# Altium project V9_BMU_REV44.PrjPcb (part 1 of 3)
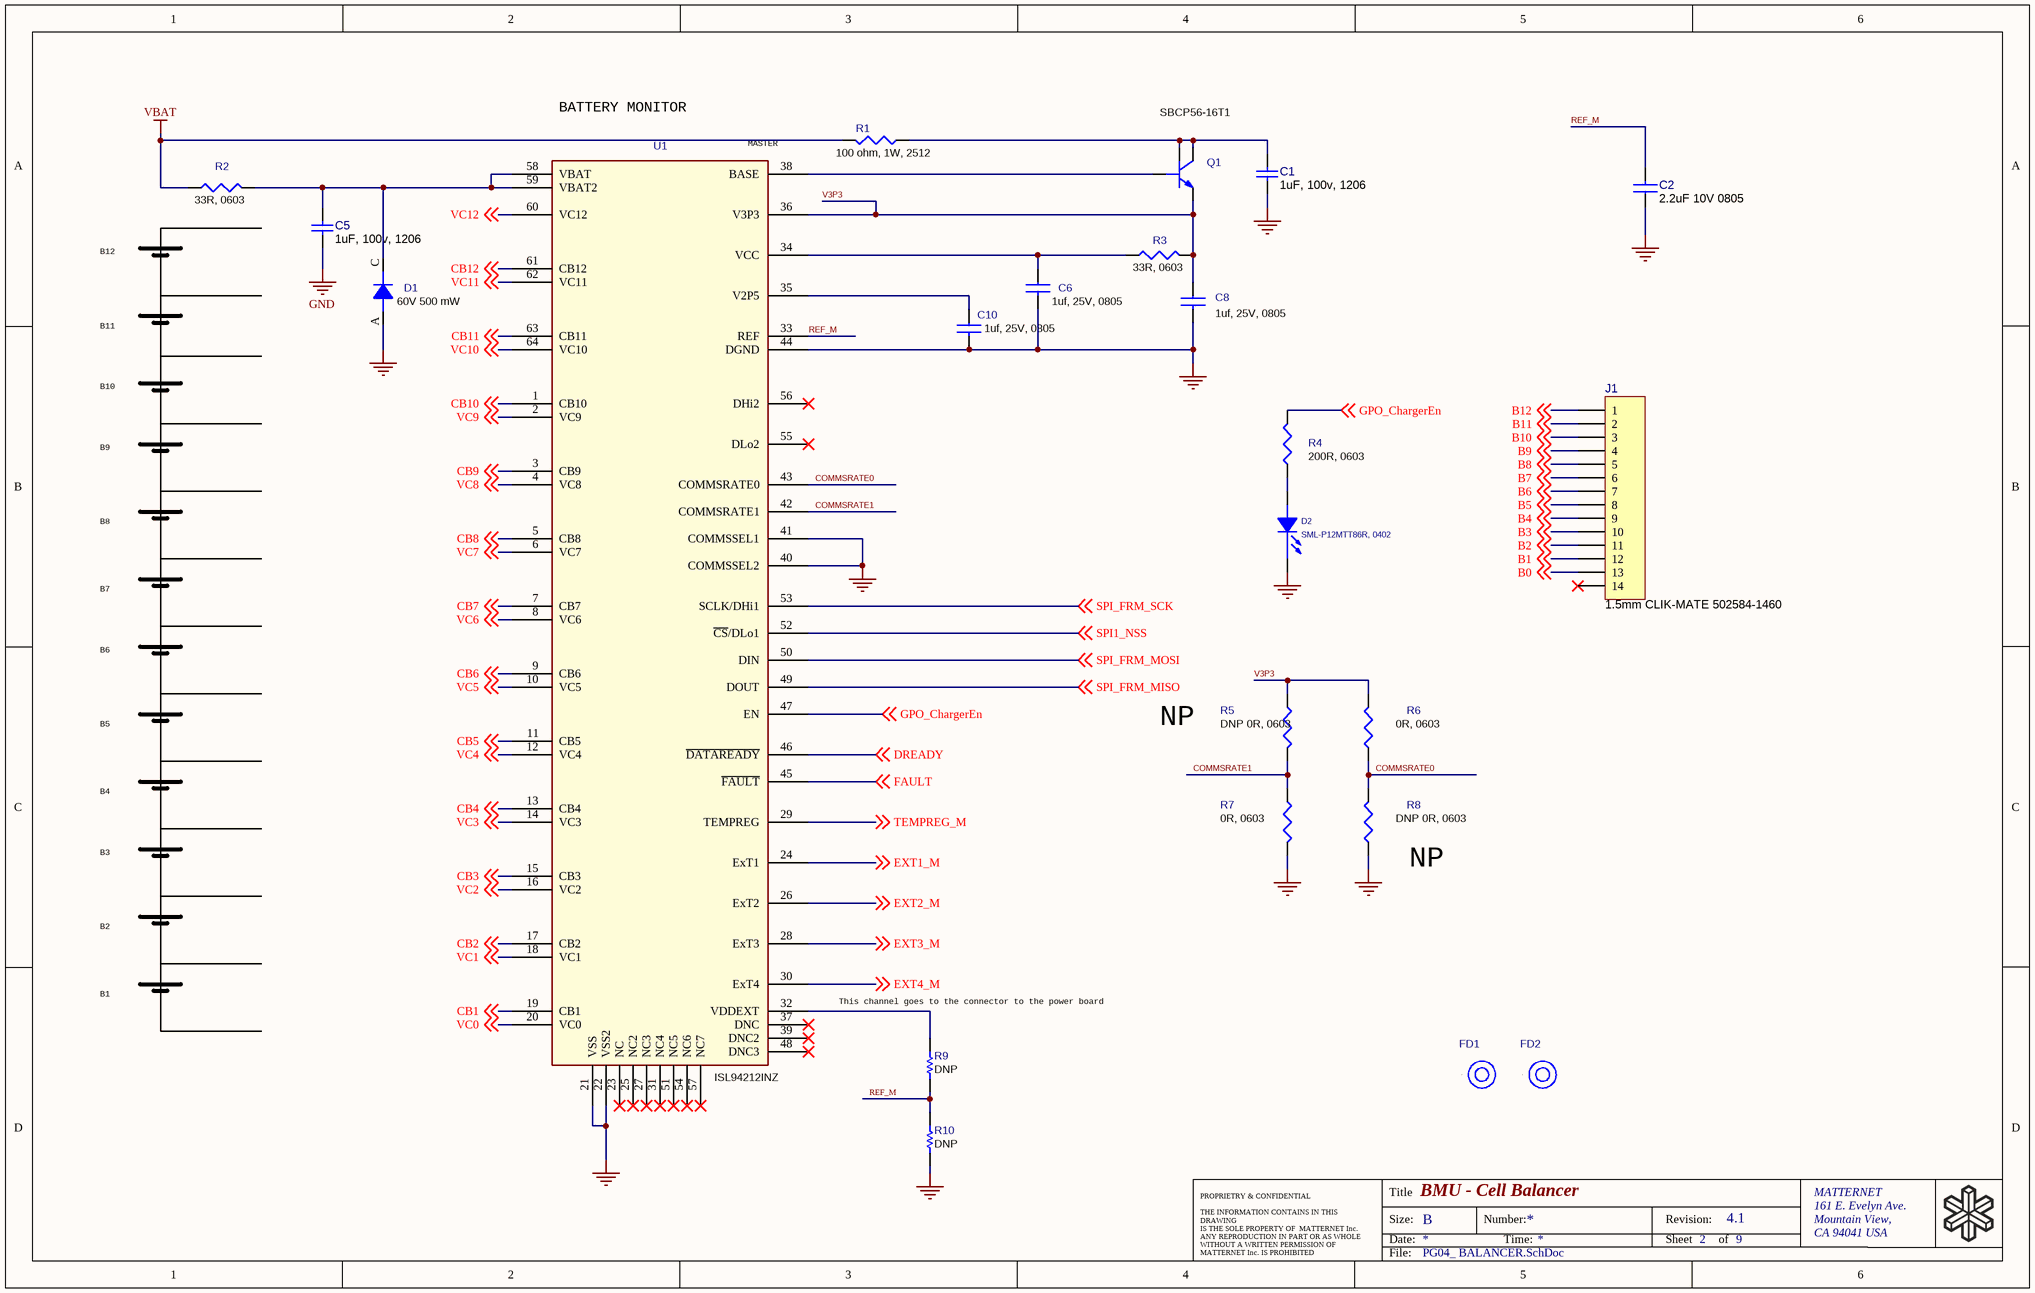
[diagram p0: PG04_ BALANCER.SchDoc]
8 sheets, 263 parts. Net scope: global (net labels, ports and power ports of the same name join across sheets).
Board file: PCB.PcbDoc
Sheets:
  PG04_ BALANCER.SchDoc
  PG05_ CELLS.SchDoc
  PG09_ TEMP_BALANCER.SchDoc
  PG10_ MCU.SchDoc
  PG11_ CAN_CONN.SchDoc
  PG12_CURRENT_INTEGRATION.SchDoc
  PG14_ POWER CONTROL.SchDoc
  PG15_ Fuel Gauge.SchDoc

## Sheet PG04_ BALANCER.SchDoc: BMU - Cell Balancer
size B; Address1: 3511 EDISON WAY; Address2: MENLO PARK, CA, 94025; Revision: 4.1; SheetNumber: 2; SheetTotal: 9

### Parts
C1  1uF, 100v, 1206  [C1206]
C2  2.2uF 10V 0805  [C0805]
C5  1uF, 100v, 1206  [C1206]
C6  1uf, 25V, 0805  [C0805]
C8  1uf, 25V, 0805  [C0805]
C10  1uf, 25V, 0805  [C0805]
D1  60V 500 mW  [SOD-123]
D2  SML-P12MTT86R, 0402  [D0402]
FD1  FIDUCIAL_REF  [FIDUCIAL_REFDES]  (value not drawn)  (no BOM)
FD2  FIDUCIAL_REF  [FIDUCIAL_REFDES]  (value not drawn)  (no BOM)
J1  1.5mm CLIK-MATE 502584-1460  [CONN14_1p5mm_SM]
Q1  SBCP56-16T1  [SOT-223]
R1  100 ohm, 1W, 2512  [2512]
R2  33R, 0603  [R0603]
R3  33R, 0603  [R0603]
R4  200R, 0603  [R0603]
R5  DNP 0R, 0603  [R0603]  (no BOM)
R6  0R, 0603  [R0603]
R7  0R, 0603  [R0603]
R8  DNP 0R, 0603  [R0603]  (no BOM)
R9  DNP  [R0402]  (no BOM)
R10  DNP  [R0402]  (no BOM)
U1  ISL94212INZ  [TQFP-64]

### Nets
GND: C1.2 C2.1 C5.1 C6.2 C8.2 C10.2 D1.A(ANODE) D2.C(CATHODE) R7.2 R8.2 R10.1 U1.21(VSS) U1.22(VSS2) U1.40(COMMSSEL2) U1.41(COMMSSEL1) U1.44(DGND)
VBAT: R1.2 R2.1
B0: J1.13 ; off-sheet B0
B1: J1.12 ; off-sheet B1
B2: J1.11 ; off-sheet B2
B3: J1.10 ; off-sheet B3
B4: J1.9 ; off-sheet B4
B5: J1.8 ; off-sheet B5
B6: J1.7 ; off-sheet B6
B7: J1.6 ; off-sheet B7
B8: J1.5 ; off-sheet B8
B9: J1.4 ; off-sheet B9
B10: J1.3 ; off-sheet B10
B11: J1.2 ; off-sheet B11
B12: J1.1 ; off-sheet B12
CB1: U1.19(CB1) ; off-sheet CB1
CB2: U1.17(CB2) ; off-sheet CB2
CB3: U1.15(CB3) ; off-sheet CB3
CB4: U1.13(CB4) ; off-sheet CB4
CB5: U1.11(CB5) ; off-sheet CB5
CB6: U1.9(CB6) ; off-sheet CB6
CB7: U1.7(CB7) ; off-sheet CB7
CB8: U1.5(CB8) ; off-sheet CB8
CB9: U1.3(CB9) ; off-sheet CB9
CB10: U1.1(CB10) ; off-sheet CB10
CB11: U1.63(CB11) ; off-sheet CB11
CB12: U1.61(CB12) ; off-sheet CB12
COMMSRATE0: R6.2 R8.1 U1.43(COMMSRATE0)
COMMSRATE1: R5.2 R7.1 U1.42(COMMSRATE1)
DREADY: U1.46(~{DATAREADY}) ; off-sheet DREADY
EXT1_M: U1.24(ExT1) ; off-sheet EXT1_M
EXT2_M: U1.26(ExT2) ; off-sheet EXT2_M
EXT3_M: U1.28(ExT3) ; off-sheet EXT3_M
EXT4_M: U1.30(ExT4) ; off-sheet EXT4_M
FAULT: U1.45(~{FAULT}) ; off-sheet FAULT
GPO_ChargerEn: R4.2 U1.47(EN) ; off-sheet GPO_ChargerEn
REF_M: C2.2 R9.1 R10.2 U1.33(REF)
SPI1_NSS: U1.52(~{CS}/DLo1) ; off-sheet SPI1_NSS
SPI_FRM_MISO: U1.49(DOUT) ; off-sheet SPI_FRM_MISO
SPI_FRM_MOSI: U1.50(DIN) ; off-sheet SPI_FRM_MOSI
SPI_FRM_SCK: U1.53(SCLK/DHi1) ; off-sheet SPI_FRM_SCK
TEMPREG_M: U1.29(TEMPREG) ; off-sheet TEMPREG_M
V3P3: C8.1 Q1.3(E) R3.2 R5.1 R6.1 U1.36(V3P3)
VC0: U1.20(VC0) ; off-sheet VC0
VC1: U1.18(VC1) ; off-sheet VC1
VC2: U1.16(VC2) ; off-sheet VC2
VC3: U1.14(VC3) ; off-sheet VC3
VC4: U1.12(VC4) ; off-sheet VC4
VC5: U1.10(VC5) ; off-sheet VC5
VC6: U1.8(VC6) ; off-sheet VC6
VC7: U1.6(VC7) ; off-sheet VC7
VC8: U1.4(VC8) ; off-sheet VC8
VC9: U1.2(VC9) ; off-sheet VC9
VC10: U1.64(VC10) ; off-sheet VC10
VC11: U1.62(VC11) ; off-sheet VC11
VC12: U1.60(VC12) ; off-sheet VC12
NetC1_1: C1.1 Q1.2(C) Q1.4(C) R1.1
NetC5_2: C5.2 D1.C(CATHODE) R2.2 U1.58(VBAT) U1.59(VBAT2)
NetC6_1: C6.1 R3.1 U1.34(VCC)
NetC10_1: C10.1 U1.35(V2P5)
NetD2_A: D2.A(ANODE) R4.1
NetQ1_1: Q1.1(B) U1.38(BASE)
NetR9_2: R9.2 U1.32(VDDEXT)

Not connected (* = marked no-connect by the designer): FD1 1; FD2 1; J1 14*; U1 23(NC)* 25(NC2)* 27(NC3)* 31(NC4)* 37(DNC)* 39(DNC2)* 48(DNC3)* 51(NC5)* 54(NC6)* 55(DLo2)* 56(DHi2)* 57(NC7)*

### Notes on the sheet
- BATTERY MONITOR
- (near U1) MASTER
- B12
- B11
- B10
- B9
- B8
- B7
- B6
- B5
- NP
- B4
- B3
- (near R8) NP
- B2
- B1
- (near R9) This channel goes to the connector to the power board
- Title
- Size:
- Date:
- B
- Number:
- Time:
- Revision:
- Sheet
- of
- MATTERNET
- 161 E. Evelyn Ave.
- Mountain View,
- CA 94041 USA
- PROPRIETRY & CONFIDENTIAL
  THE INFORMATION CONTAINS IN THIS DRAWING
  IS THE SOLE PROPERTY OF  MATTERNET Inc.
  ANY REPRODUCTION IN PART OR AS WHOLE
  WITHOUT A WRITTEN PERMISSION OF
  MATTERNET Inc. IS PROHIBITED
- File:

### Library data of the parts
C1 C5 = Cap: CAP CER 1UF 100V X7R 1210 AUTO F; Manufacturer: KEMET; Manufacturer Part Number: C1210X105K1RACAUTO; Dielectric Material: Ceramic; Tolerance: 10%; Supplier 1: Digi-Key; Supplier Part Number 1: 399-16434-1-ND; Stock 1: 335; Pricing 1: 1=2.07, 10=1.677, 100=1.2803, 500=0.9755, 1000=0.85356 (USD); Case/Package: 1210; Voltage Rating (DC): 100V; Dielectric: X7R; Capacitance: 1uF
C2 = CAP-Generic-0805: CAP CER 2.2UF 10V 10% X7R 0805; Manufacturer: KEMET; Manufacturer Part Number: C0805X225K8RACAUTO; Dielectric Material: Ceramic; Supplier 1: Digi-Key; Supplier Part Number 1: 399-11602-1-ND; Stock 1: 2328; Pricing 1: 1=0.9, 10=0.667, 100=0.4571, 500=0.36184, 1000=0.3047 (USD); Mount: Surface Mount; Case/Package: 0805; Case Code (Metric): 2012; Case Code (Imperial): 0805; Min Operating Temperature: -55°C; Max Operating Temperature: 125°C; Packaging: Tape and Reel; Capacitance: 2.2uF; Voltage Rating: 10V; Tolerance: 10%; Voltage Rating (DC): 10V; Dielectric: X7R; Features: Soft Termination; Length: 0.079inch; Width: 0.049inch; Thickness: 0.055inch; Ratings: AEC-Q200; Supplier 2: Mouser; Supplier Part Number 2: 80-C0805X225K8RAUTO; Stock 2: 4965; Pricing 2: 1=1.06, 10=0.715, 50=0.715, 100=0.446, 1000=0.369, 10000=0.228 (USD)
C6 C8 C10 = CAP-Generic-0402: CAP CER 1UF 25V X7R 0805; Manufacturer: Murata; Manufacturer Part Number: GCJ21BR71E105KA12L; Tolerance: 10%; Supplier 1: Digi-Key; Supplier Part Number 1: 490-5802-1-ND; Stock 1: 116649; Pricing 1: 1=0.48, 10=0.333, 100=0.1997, 500=0.14974, 1000=0.12645 (USD); Mount: Surface Mount; Case/Package: 0805; Case Code (Imperial): 0805; Case Code (Metric): 2012; Min Operating Temperature: -55°C; Max Operating Temperature: 125°C; Capacitance: 1uF; Voltage Rating: 25V; Voltage Rating (DC): 25V; Packaging: Tape and Reel; Package Quantity: 3000; Dielectric: X7R; Termination: SMD/SMT; Features: Soft Termination; Length: 2mm; Width: 1.25mm; Thickness: 0.057inch; Depth: 1.25mm; Ratings: AEC-Q200; Lead Free: Lead Free
D1 = DIO-GENERIC: DIODE ZENER 60V 500MW SOD123; Manufacturer: ON Semiconductor; Manufacturer Part Number: MMSZ5264BT1G; custprt: 100-0500-000184; custinv: Ansync; Option: AB; Material: Plastic; Tolerance: 5%; Impedance: 170R; Forward Voltage: 900mV; Max Reverse Leakage Current: 100nA; Zener Current: 10mA; Test Current: 2.1mA; Element Configuration: Single; ESD Protection: Yes; Supplier 1: Digi-Key; Supplier Part Number 1: MMSZ5264BT1GOSCT-ND; Stock 1: 0; Pricing 1: 1=0.25, 10=0.201, 100=0.1067, 500=0.07016, 1000=0.04771 (USD); Case/Package: SOD-123-2; Number of Pins: 2; Contact Plating: Matte,Tin; Min Operating Temperature: -55°C; Max Operating Temperature: 150°C; Packaging: Tape and Reel; Max Power Dissipation: 500mW; Zener Voltage: 60V; Voltage Rating (DC): 60V; Power Rating: 500mW; Package Quantity: 1; Voltage Tolerance: 5%; Power Dissipation: 500mW; Working Voltage: 60V; Peak Reverse Current: 100nA; Length: 2.84mm; Height: 1.25mm; Width: 1.8mm; Radiation Hardening: No; Lead Free: Lead Free; ComponentLink1URL: http://www.onsemi.com/pub/Collateral/MMSZ5221BT1-D.PDF; ComponentLink1Description: http://www.onsemi.com/pub/Collateral/MMSZ5221BT1-D.PDF; ComponentLink2URL: https://www.verical.com/server-webapp/html/getDatasheet?partID=107391; ComponentLink2Description: https://www.verical.com/server-webapp/html/getDatasheet?partID=107391; ComponentLink3URL: http://www.mouser.com/ds/2/308/MMSZ5221BT1-D-85810.pdf; ComponentLink3Description: http://www.mouser.com/ds/2/308/MMSZ5221BT1-D-85810.pdf; ComponentLink4URL: http://www.onsemi.com/pub_link/Collateral/MMSZ5221BT1-D.PDF; ComponentLink4Description: http://www.onsemi.com/pub_link/Collateral/MMSZ5221BT1-D.PDF; ComponentLink5URL: http://uk.rs-online.com/webdocs/1276/0900766b81276af2.pdf; ComponentLink5Description: http://uk.rs-online.com/webdocs/1276/0900766b81276af2.pdf; Supplier 2: Mouser; Supplier Part Number 2: 863-MMSZ5264BT1G; Stock 2: 694; Pricing 2: 1=0.23, 10=0.156, 50=0.156, 100=0.065, 1000=0.045, 10000=0.03 (USD)
D2 = LED-GENERIC: custinv: Ansync; custprt: 100-0500-000159; Option: AB
FD1 FD2 = FIDUCIAL_REF: Option: AB
J1 = Header 14: CONN RCPT 14POS 0.059 TIN SMD; Manufacturer: Molex; Current Rating: 2A; Voltage Rating: 100V; Number of Positions: 14; Connector Type: Forked,Receptacle; Gender: Female; Glow Wire Compliant: Non-compliant; ComponentLink1URL: http://www.mouser.com/ds/2/276/5025841460_PCB_RECEPTACLES-179505.pdf; ComponentLink1Description: http://www.mouser.com/ds/2/276/5025841460_PCB_RECEPTACLES-179505.pdf; ComponentLink2URL: http://www.molex.com/pdm_docs/sd/5025841460_sd.pdf; ComponentLink2Description: http://www.molex.com/pdm_docs/sd/5025841460_sd.pdf; ComponentLink3URL: http://www.molex.com/webdocs/datasheets/pdf/en-us/5025841460_PCB_RECEPTACLES.pdf; ComponentLink3Description: http://www.molex.com/webdocs/datasheets/pdf/en-us/5025841460_PCB_RECEPTACLES.pdf; Supplier 1: Digikey; Supplier Part Number 1: WM20814CT-ND; Manufacturer Part Number: 502584-1460; Stock 1: 900; Pricing 1: 1=2.58, 10=2.341, 100=2.0064 (USD); Mount: Surface Mount; Color: Beige; Contact Plating: Tin; Contact Gender: Female; Package Quantity: 900; Number of Rows: 1; Packaging: Tape and Reel; Fastening Type: Latch; Termination: Solder; Number of Contacts: 14; Orientation: Vertical; Number of Circuits: 14; Pitch: 1.5mm; Radiation Hardening: No; REACH SVHC: No SVHC; Supplier 2: Mouser; Supplier Part Number 2: 538-502584-1460; Stock 2: 5330; Pricing 2: 1=1.96, 10=1.75, 50=1.75, 100=1.52, 1000=1.09, 10000=0.96 (USD); ComponentLink4URL: http://www.mouser.com/ds/2/276/5025841460_PCB_RECEPTACLES-179505.pdf?src-supplier=Mouser; ComponentLink4Description: http://www.mouser.com/ds/2/276/5025841460_PCB_RECEPTACLES-179505.pdf?src-supplier=Mouser; ComponentLink5URL: http://www.molex.com/pdm_docs/sd/5025841460_sd.pdf?src-supplier=Digi-Key; ComponentLink5Description: http://www.molex.com/pdm_docs/sd/5025841460_sd.pdf?src-supplier=Digi-Key; ComponentLink6URL: http://www.molex.com/webdocs/datasheets/pdf/en-us/5025841460_PCB_RECEPTACLES.pdf?src-supplier=Avnet; ComponentLink6Description: http://www.molex.com/webdocs/datasheets/pdf/en-us/5025841460_PCB_RECEPTACLES.pdf?src-supplier=Avnet
Q1 = Trans-Generic_2: TRANS NPN 80V 1.0A SOT-223; Manufacturer: ON Semiconductor; Manufacturer Part Number: SBCP56-16T1G; Max Power Dissipation: 1.5W; Frequency: 130MHz; hFE Min: 25; Max Collector Current: 1A; Collector Emitter Saturation Voltage: 500mV; Collector Base Voltage (VCBO): 100V; Number of Elements: 1; Emitter Base Voltage (VEBO): 5V; Element Configuration: Single; Supplier 1: Digi-Key; Supplier Part Number 1: SBCP56-16T1GOSCT-ND; Stock 1: 10870; Pricing 1: 1=0.59, 10=0.505, 100=0.3767, 500=0.29598 (USD); Case/Package: SOT-223-4; Number of Pins: 4; Min Operating Temperature: -65°C; Max Operating Temperature: 150°C; Package Quantity: 1000; Packaging: Tape and Reel; Collector Emitter Voltage (VCEO): 80V; Transition Frequency: 130MHz; Collector Emitter Breakdown Voltage: 80V; Polarity: NPN; Max Breakdown Voltage: 80V; Power Dissipation: 1.5W; Gain Bandwidth Product: 130MHz; Max Frequency: 130MHz; Length: 6.7mm; Height: 1.65mm; Width: 3.7mm; Radiation Hardening: No; Lead Free: Lead Free; ComponentLink1URL: http://www.onsemi.com/pub/Collateral/BCP56T1-D.PDF?src-supplier=Digi-Key; ComponentLink1Description: http://www.onsemi.com/pub/Collateral/BCP56T1-D.PDF?src-supplier=Digi-Key; ComponentLink2URL: http://www.onsemi.com/pub_link/Collateral/BCP56T1-D.PDF?src-supplier=Future+Electronics; ComponentLink2Description: http://www.onsemi.com/pub_link/Collateral/BCP56T1-D.PDF?src-supplier=Future+Electronics; ComponentLink3URL: http://www.onsemi.com/pub/Collateral/BCP56T1-D.PDF?src-supplier=Avnet+Europe; ComponentLink3Description: http://www.onsemi.com/pub/Collateral/BCP56T1-D.PDF?src-supplier=Avnet+Europe; Supplier 2: Mouser; Supplier Part Number 2: 863-SBCP56-16T1G; Stock 2: 108192; Pricing 2: 1=0.55, 10=0.45, 50=0.45, 100=0.274, 1000=0.212, 10000=0.168 (USD)
R1 = R-Generic: RES SMD 100 OHM 5% 1W 2512; Manufacturer: Panasonic; Manufacturer Part Number: ERJ-1TYJ101U; custprt: 100-0100-000214; custinv: Ansync; Option: AB; Resistance: 100R; Temperature Coefficient: 200ppm/°C; Voltage Rating: 200V; Voltage Rating (DC): 250V; Supplier 1: Mouser; Supplier Part Number 1: 667-ERJ-1TYJ101U; Stock 1: 275; Pricing 1: 1=0.39, 10=0.28, 50=0.169, 100=0.125, 1000=0.07, 10000=0.053 (USD); Mount: Surface Mount; Case/Package: 2512; Contact Plating: Tin; Case Code (Metric): 6432; Case Code (Imperial): 2512; Min Operating Temperature: -55°C; Max Operating Temperature: 155°C; Tolerance: 5%; Power Rating: 1W; Composition: Thick Film; Packaging: Tape and Reel; Package Quantity: 4000; Number of Terminations: 2; Termination: SMD/SMT; Military Standard: Not; Max Power Dissipation: 1W; Features: Automotive AEC-Q200; Length: 6.4mm; Height: 0.6mm; Width: 0.126inch; Depth: 3.2mm; Radiation Hardening: No; REACH SVHC: No SVHC; Lead Free: Lead Free; ComponentLink1URL: http://www.farnell.com/datasheets/1678796.pdf; ComponentLink1Description: http://www.farnell.com/datasheets/1678796.pdf; ComponentLink2URL: http://industrial.panasonic.com/www-data/pdf/AOA0000/AOA0000CE1.pdf; ComponentLink2Description: http://industrial.panasonic.com/www-data/pdf/AOA0000/AOA0000CE1.pdf; ComponentLink3URL: http://www.mouser.com/ds/2/315/AOA0000C84-947596.pdf; ComponentLink3Description: http://www.mouser.com/ds/2/315/AOA0000C84-947596.pdf; ComponentLink4URL: https://www.alliedelec.com/m/d/51cd0790071e1666bdb9d00c57fcf960.pdf; ComponentLink4Description: https://www.alliedelec.com/m/d/51cd0790071e1666bdb9d00c57fcf960.pdf
R2 R3 = R-Generic-0603: RES SMD 33 OHM 1% 1/10W 0603; Manufacturer: Yageo; Manufacturer Part Number: AC0603FR-0733RL; custprt: 100-0110-000153; custinv: Ansync; Option: AB; Power Rating: 100mW; Voltage Rating: 50V; Temperature Coefficient: 100ppm/°C; Supplier 1: Digi-Key; Supplier Part Number 1: YAG3599CT-ND; Stock 1: 70551; Pricing 1: 1=0.1, 10=0.032, 100=0.0129, 1000=0.00579, 2500=0.00502 (USD); Case/Package: 0603; Case Code (Imperial): 0603; Case Code (Metric): 1608; Min Operating Temperature: -55°C; Max Operating Temperature: 155°C; Packaging: Tape and Reel; Resistance: 33R; Tolerance: 1%; Composition: Thick Film; Termination: SMD/SMT; Number of Terminations: 2; Max Power Dissipation: 100mW; Features: Automotive AEC-Q200,Moisture Resistant; Length: 0.063inch; Height: 0.022inch; Width: 0.8mm
R4 = R-Generic-0603: RES SMD 200 OHM 1% 1/10W 0603; Manufacturer: Yageo; Manufacturer Part Number: AC0603FR-07200RL; custprt: 100-0110-000074; custinv: Ansync; Option: AB; Max Power Dissipation: 100mW; Temperature Coefficient: 100ppm/°C; Supplier 1: Digi-Key; Supplier Part Number 1: YAG3576CT-ND; Stock 1: 46237; Pricing 1: 1=0.1, 10=0.032, 100=0.0129, 1000=0.00579, 2500=0.00502 (USD); Case/Package: 0603; Case Code (Metric): 1608; Case Code (Imperial): 0603; Min Operating Temperature: -55°C; Max Operating Temperature: 155°C; Packaging: Tape and Reel; Resistance: 200R; Composition: Thick Film; Number of Terminations: 2; Tolerance: 1%; Features: Automotive AEC-Q200,Moisture Resistant; Length: 0.063inch; Height: 0.022inch; Width: 0.031inch
R5 R8 = R-Generic-0402: DNP; custinv: Ansync; custprt: 100-0120-000002; Option: N
R6 R7 = R-Generic-0402: RES SMD 0 OHM JUMPER 1/10W 0603; Manufacturer: Yageo; Manufacturer Part Number: RC0603FR-070RL; custinv: Ansync; custprt: 100-0120-000002; Option: AB; Resistance: 0mR; Power Rating: 100mW; Tolerance: 1%; Voltage Rating (DC): 50V; Temperature Coefficient: 200ppm/°C; Current Rating: 1A; Working Voltage: 75V; Supplier 1: Digi-Key; Supplier Part Number 1: 311-0.0HRCT-ND; Stock 1: 3289463; Pricing 1: 1=0.1, 10=0.021, 25=0.0152, 50=0.0114, 100=0.0084, 250=0.00644, 500=0.00514, 1000=0.00379 (USD); Case/Package: 0603; Number of Pins: 2; Contact Plating: Matte,Tin; Case Code (Metric): 1608; Case Code (Imperial): 0603; Min Operating Temperature: -55°C; Max Operating Temperature: 155°C; Composition: Thick Film; Packaging: Tape and Reel; Package Quantity: 5000; Voltage Rating: 50V; Number of Terminations: 2; Termination: SMD/SMT; Military Standard: Not; Max Power Dissipation: 100mW; Features: Moisture Resistant; Length: 1.6mm; Height: 0.45mm; Width: 0.031inch; Depth: 0.8mm; Radiation Hardening: No; REACH SVHC: No SVHC; Lead Free: Lead Free; ComponentLink1URL: http://www.farnell.com/datasheets/1868787.pdf; ComponentLink1Description: http://www.farnell.com/datasheets/1868787.pdf; ComponentLink2URL: http://www.farnell.com/datasheets/443971.pdf; ComponentLink2Description: http://www.farnell.com/datasheets/443971.pdf; ComponentLink3URL: http://www.yageo.com/documents/recent/PYu-RC_Group_51_RoHS_L_9.pdf; ComponentLink3Description: http://www.yageo.com/documents/recent/PYu-RC_Group_51_RoHS_L_9.pdf; ComponentLink4URL: http://documents.rs-components.com/techlib://itc_doclist_GB.htm?stockno=5048827; ComponentLink4Description: http://documents.rs-components.com/techlib://itc_doclist_GB.htm?stockno=5048827
R9 R10 = Res1: Resistor; Published: 8-Jun-2000; LatestRevisionDate: 17-Jul-2002; LatestRevisionNote: Re-released for DXP Platform.; PackageReference: AXIAL-0.3; Publisher: Altium Limited; PackageDescription: Axial Device, Thru-Hole; 2 Leads; 0.3 in Pin Spacing
U1 = BATTMAN-ISL94212INZ-700-498: Battery Management Multi-Cell Li-Ion Battery Manager; Manufacturer: Renesas; Option: AB; Max Supply Current: 5mA; Mount: Surface Mount; Case/Package: QFP; Number of Pins: 64; Min Operating Temperature: -40°C; Max Operating Temperature: 85°C; Package Quantity: 160; Packaging: Tray; Radiation Hardening: No; ComponentLink1URL: http://www.intersil.com/products/deviceinfo.asp?pn=ISL94212; ComponentLink1Description: http://www.intersil.com/products/deviceinfo.asp?pn=ISL94212; ComponentLink2URL: http://www.intersil.com/content/dam/Intersil/documents/isl9/isl94212.pdf; ComponentLink2Description: http://www.intersil.com/content/dam/Intersil/documents/isl9/isl94212.pdf; Supplier 1: Mouser; Supplier Part Number 1: 968-ISL94212INZ; Stock 1: 447; Pricing 1: 1=11.53, 10=10.42, 50=9.94, 100=8.63, 1000=6.55, 10000=6.55 (USD); Manufacturer Part Number: ISL94212INZ

## Sheet PG05_ CELLS.SchDoc: BMU - Cell Balancer 2
size C; Address1: 3511 EDISON WAY; Address2: MENLO PARK, CA, 94025; DocumentNumber: 1; Revision: 4.1; SheetNumber: 3; SheetTotal: 9
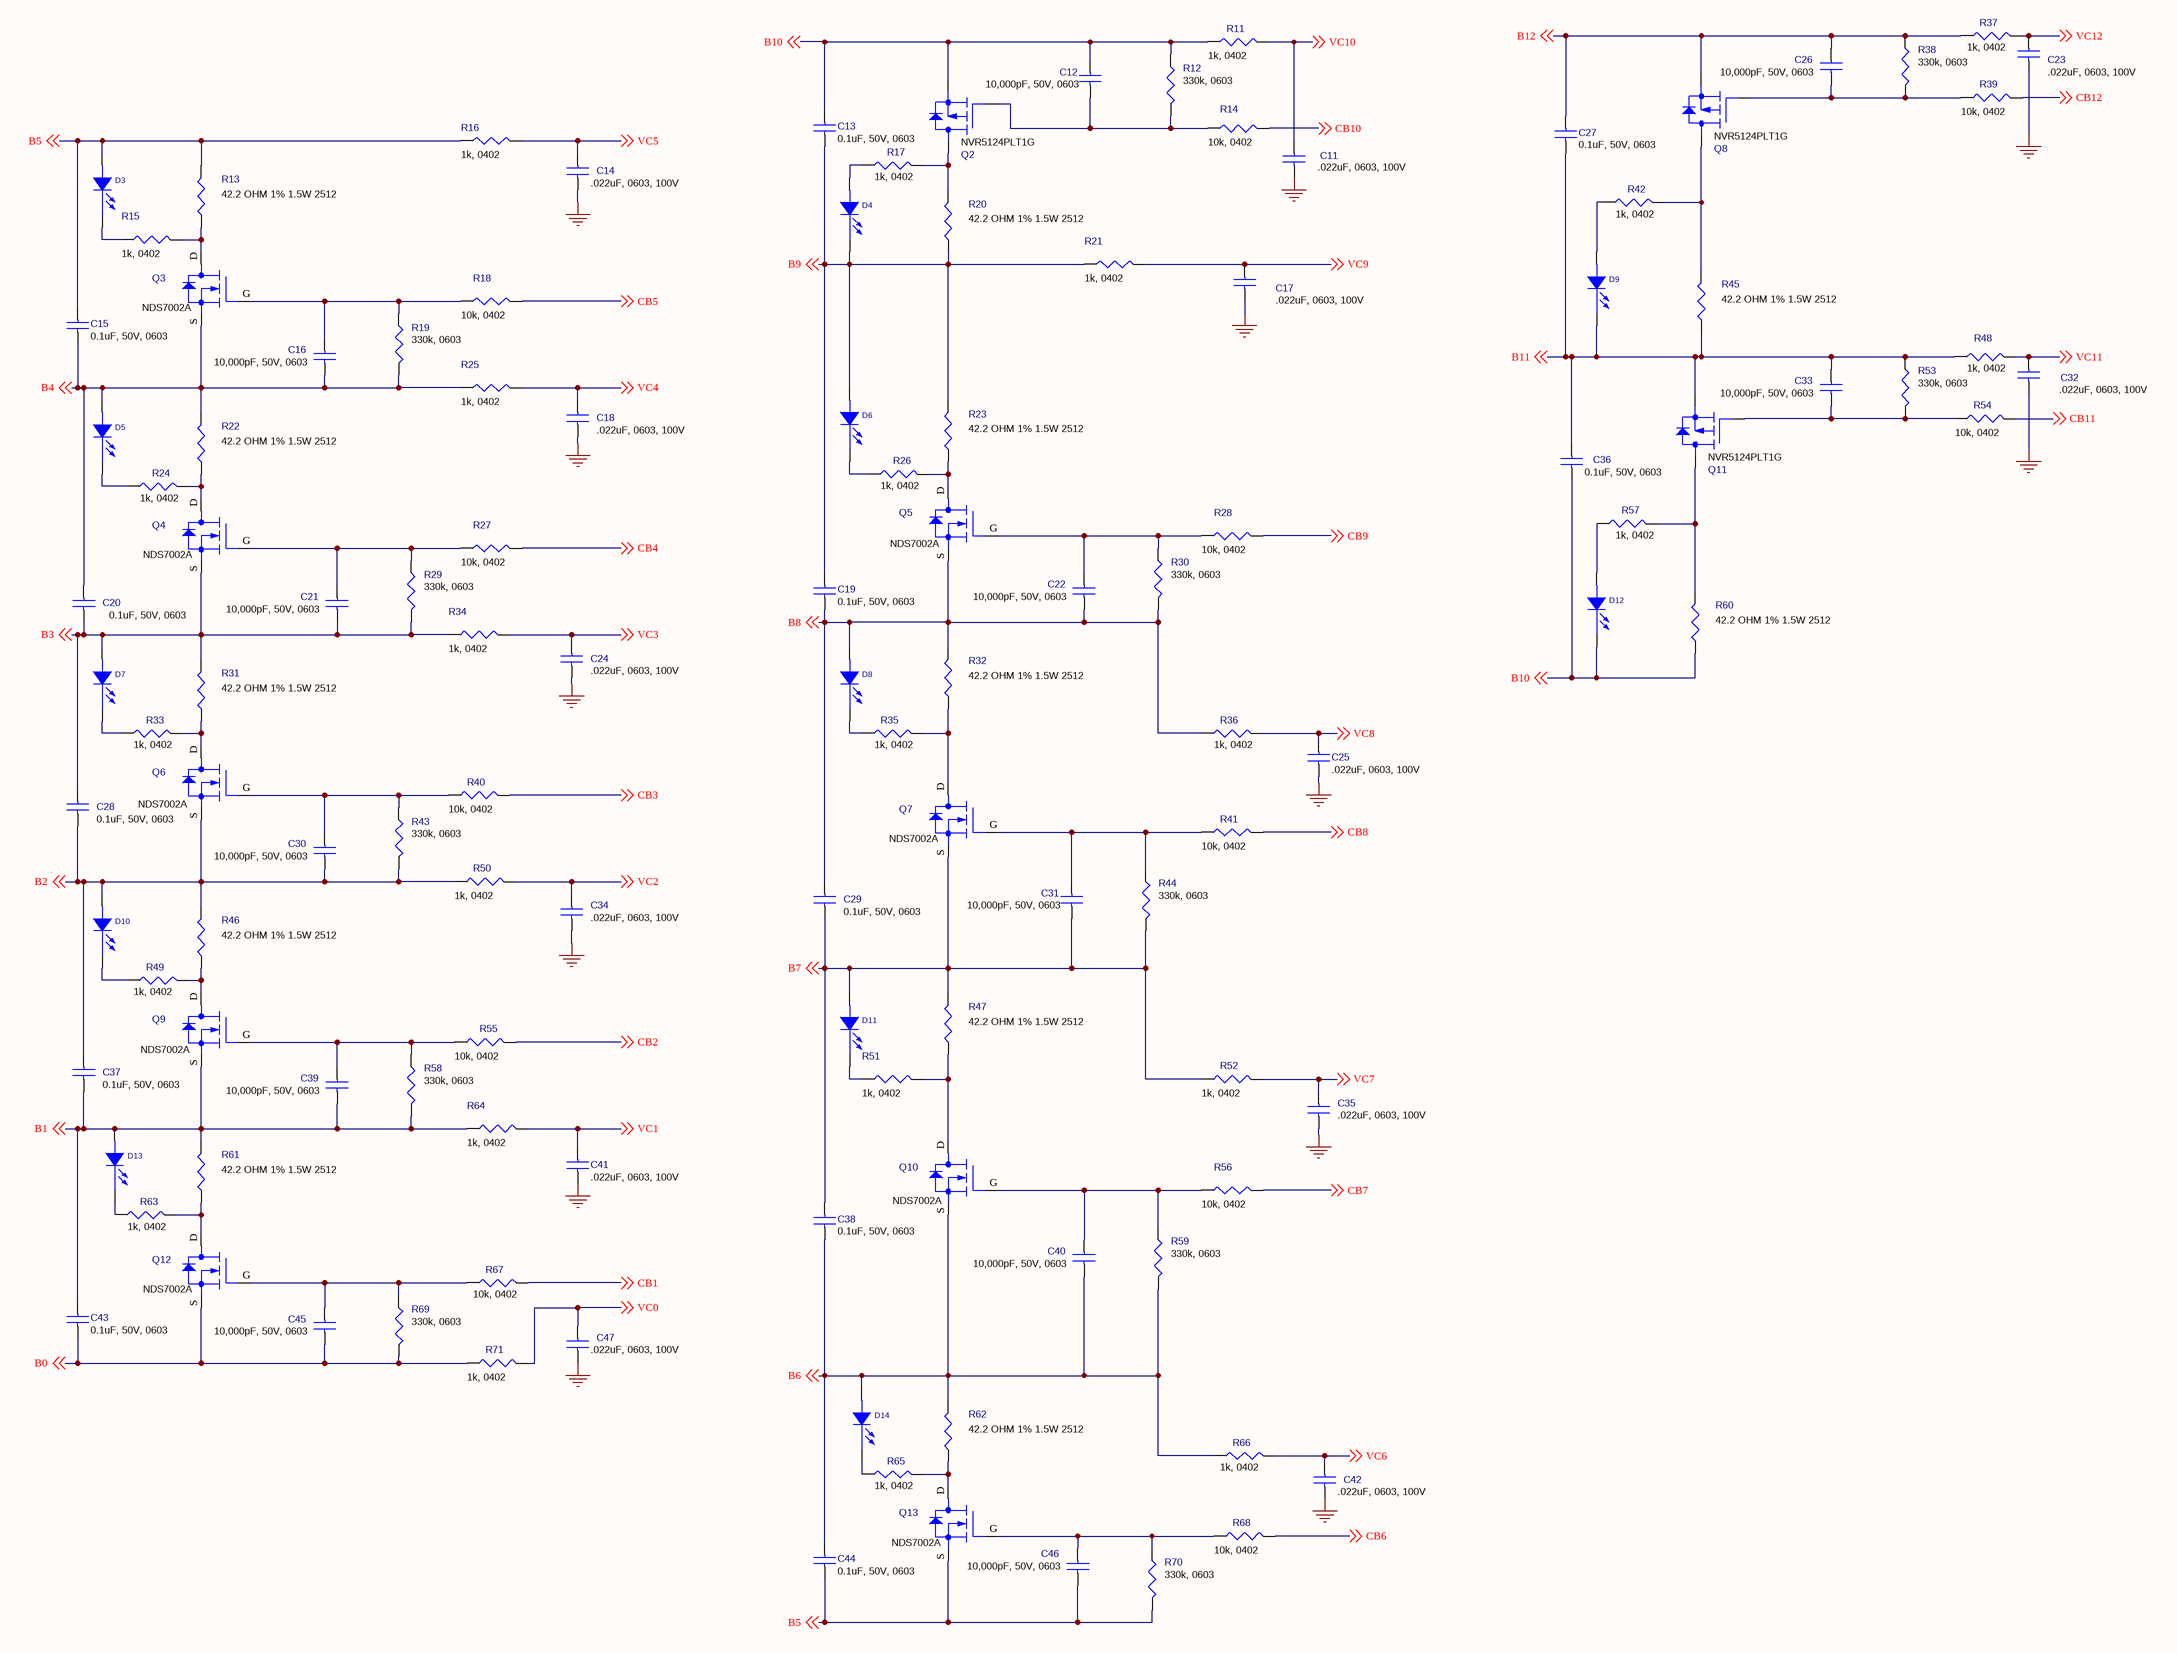
[diagram p1: PG05_ CELLS.SchDoc]

### Parts
C11  .022uF, 0603, 100V  [C0603]
C12  10,000pF, 50V, 0603  [C0603]
C13  0.1uF, 50V, 0603  [C0603]
C14  .022uF, 0603, 100V  [C0603]
C15  0.1uF, 50V, 0603  [C0603]
C16  10,000pF, 50V, 0603  [C0603]
C17  .022uF, 0603, 100V  [C0603]
C18  .022uF, 0603, 100V  [C0603]
C19  0.1uF, 50V, 0603  [C0603]
C20  0.1uF, 50V, 0603  [C0603]
C21  10,000pF, 50V, 0603  [C0603]
C22  10,000pF, 50V, 0603  [C0603]
C23  .022uF, 0603, 100V  [C0603]
C24  .022uF, 0603, 100V  [C0603]
C25  .022uF, 0603, 100V  [C0603]
C26  10,000pF, 50V, 0603  [C0603]
C27  0.1uF, 50V, 0603  [C0603]
C28  0.1uF, 50V, 0603  [C0603]
C29  0.1uF, 50V, 0603  [C0603]
C30  10,000pF, 50V, 0603  [C0603]
C31  10,000pF, 50V, 0603  [C0603]
C32  .022uF, 0603, 100V  [C0603]
C33  10,000pF, 50V, 0603  [C0603]
C34  .022uF, 0603, 100V  [C0603]
C35  .022uF, 0603, 100V  [C0603]
C36  0.1uF, 50V, 0603  [C0603]
C37  0.1uF, 50V, 0603  [C0603]
C38  0.1uF, 50V, 0603  [C0603]
C39  10,000pF, 50V, 0603  [C0603]
C40  10,000pF, 50V, 0603  [C0603]
C41  .022uF, 0603, 100V  [C0603]
C42  .022uF, 0603, 100V  [C0603]
C43  0.1uF, 50V, 0603  [C0603]
C44  0.1uF, 50V, 0603  [C0603]
C45  10,000pF, 50V, 0603  [C0603]
C46  10,000pF, 50V, 0603  [C0603]
C47  .022uF, 0603, 100V  [C0603]
D3  SML-P12MTT86R, 0402  [D0402]  (value not drawn)
D4  SML-P12MTT86R, 0402  [D0402]  (value not drawn)
D5  SML-P12MTT86R, 0402  [D0402]  (value not drawn)
D6  SML-P12MTT86R, 0402  [D0402]  (value not drawn)
D7  SML-P12MTT86R, 0402  [D0402]  (value not drawn)
D8  SML-P12MTT86R, 0402  [D0402]  (value not drawn)
D9  SML-P12MTT86R, 0402  [D0402]  (value not drawn)
D10  SML-P12MTT86R, 0402  [D0402]  (value not drawn)
D11  SML-P12MTT86R, 0402  [D0402]  (value not drawn)
D12  SML-P12MTT86R, 0402  [D0402]  (value not drawn)
D13  SML-P12MTT86R, 0402  [D0402]  (value not drawn)
D14  SML-P12MTT86R, 0402  [D0402]  (value not drawn)
Q2  NVR5124PLT1G  [SOT-23]
Q3  NDS7002A  [SOT-23]
Q4  NDS7002A  [SOT-23]
Q5  NDS7002A  [SOT-23]
Q6  NDS7002A  [SOT-23]
Q7  NDS7002A  [SOT-23]
Q8  NVR5124PLT1G  [SOT-23]
Q9  NDS7002A  [SOT-23]
Q10  NDS7002A  [SOT-23]
Q11  NVR5124PLT1G  [SOT-23]
Q12  NDS7002A  [SOT-23]
Q13  NDS7002A  [SOT-23]
R11  1k, 0402  [R0402]
R12  330k, 0603  [R0603]
R13  42.2 OHM 1% 1.5W 2512  [2512]
R14  10k, 0402  [R0402]
R15  1k, 0402  [R0402]
R16  1k, 0402  [R0402]
R17  1k, 0402  [R0402]
R18  10k, 0402  [R0402]
R19  330k, 0603  [R0603]
R20  42.2 OHM 1% 1.5W 2512  [2512]
R21  1k, 0402  [R0402]
R22  42.2 OHM 1% 1.5W 2512  [2512]
R23  42.2 OHM 1% 1.5W 2512  [2512]
R24  1k, 0402  [R0402]
R25  1k, 0402  [R0402]
R26  1k, 0402  [R0402]
R27  10k, 0402  [R0402]
R28  10k, 0402  [R0402]
R29  330k, 0603  [R0603]
R30  330k, 0603  [R0603]
R31  42.2 OHM 1% 1.5W 2512  [2512]
R32  42.2 OHM 1% 1.5W 2512  [2512]
R33  1k, 0402  [R0402]
R34  1k, 0402  [R0402]
R35  1k, 0402  [R0402]
R36  1k, 0402  [R0402]
R37  1k, 0402  [R0402]
R38  330k, 0603  [R0603]
R39  10k, 0402  [R0402]
R40  10k, 0402  [R0402]
R41  10k, 0402  [R0402]
R42  1k, 0402  [R0402]
R43  330k, 0603  [R0603]
R44  330k, 0603  [R0603]
R45  42.2 OHM 1% 1.5W 2512  [2512]
R46  42.2 OHM 1% 1.5W 2512  [2512]
R47  42.2 OHM 1% 1.5W 2512  [2512]
R48  1k, 0402  [R0402]
R49  1k, 0402  [R0402]
R50  1k, 0402  [R0402]
R51  1k, 0402  [R0402]
R52  1k, 0402  [R0402]
R53  330k, 0603  [R0603]
R54  10k, 0402  [R0402]
R55  10k, 0402  [R0402]
R56  10k, 0402  [R0402]
R57  1k, 0402  [R0402]
R58  330k, 0603  [R0603]
R59  330k, 0603  [R0603]
R60  42.2 OHM 1% 1.5W 2512  [2512]
R61  42.2 OHM 1% 1.5W 2512  [2512]
R62  42.2 OHM 1% 1.5W 2512  [2512]
R63  1k, 0402  [R0402]
R64  1k, 0402  [R0402]
R65  1k, 0402  [R0402]
R66  1k, 0402  [R0402]
R67  10k, 0402  [R0402]
R68  10k, 0402  [R0402]
R69  330k, 0603  [R0603]
R70  330k, 0603  [R0603]
R71  1k, 0402  [R0402]

### Nets
GND: C11.2 C14.2 C17.2 C18.2 C23.2 C24.2 C25.2 C32.2 C34.2 C35.2 C41.2 C42.2 C47.2
B0: C43.2 C45.2 Q12.S(SOURCE) R69.2 R71.1 ; off-sheet B0
B1: C37.2 C39.2 C43.1 D13.A(ANODE) Q9.S(SOURCE) R58.2 R61.2 R64.1 ; off-sheet B1
B2: C28.2 C30.2 C37.1 D10.A(ANODE) Q6.S(SOURCE) R43.2 R46.2 R50.1 ; off-sheet B2
B3: C20.2 C21.2 C28.1 D7.A(ANODE) Q4.S(SOURCE) R29.2 R31.2 R34.1 ; off-sheet B3
B4: C15.2 C16.2 C20.1 D5.A(ANODE) Q3.S(SOURCE) R19.2 R22.2 R25.1 ; off-sheet B4
B5: C15.1 C44.2 C46.2 D3.A(ANODE) Q13.S(SOURCE) R13.2 R16.1 R70.2 ; off-sheet B5
B6: C38.2 C40.2 C44.1 D14.A(ANODE) Q10.S(SOURCE) R59.2 R62.2 R66.1 ; off-sheet B6
B7: C29.2 C31.2 C38.1 D11.A(ANODE) Q7.S(SOURCE) R44.2 R47.2 R52.1 ; off-sheet B7
B8: C19.2 C22.2 C29.1 D8.A(ANODE) Q5.S(SOURCE) R30.2 R32.2 R36.1 ; off-sheet B8
B9: C13.2 C19.1 D4.C(CATHODE) D6.A(ANODE) R20.1 R21.1 R23.2 ; off-sheet B9
B10: C12.1 C13.1 C36.2 D12.C(CATHODE) Q2.S R11.1 R12.1 R60.1 ; off-sheet B10
B11: C27.2 C33.1 C36.1 D9.C(CATHODE) Q11.S R45.1 R48.1 R53.1 ; off-sheet B11
B12: C26.1 C27.1 Q8.S R37.1 R38.1 ; off-sheet B12
CB1: R67.2 ; off-sheet CB1
CB2: R55.2 ; off-sheet CB2
CB3: R40.2 ; off-sheet CB3
CB4: R27.2 ; off-sheet CB4
CB5: R18.2 ; off-sheet CB5
CB6: R68.2 ; off-sheet CB6
CB7: R56.2 ; off-sheet CB7
CB8: R41.2 ; off-sheet CB8
CB9: R28.2 ; off-sheet CB9
CB10: R14.2 ; off-sheet CB10
CB11: R54.2 ; off-sheet CB11
CB12: R39.2 ; off-sheet CB12
VC0: C47.1 R71.2 ; off-sheet VC0
VC1: C41.1 R64.2 ; off-sheet VC1
VC2: C34.1 R50.2 ; off-sheet VC2
VC3: C24.1 R34.2 ; off-sheet VC3
VC4: C18.1 R25.2 ; off-sheet VC4
VC5: C14.1 R16.2 ; off-sheet VC5
VC6: C42.1 R66.2 ; off-sheet VC6
VC7: C35.1 R52.2 ; off-sheet VC7
VC8: C25.1 R36.2 ; off-sheet VC8
VC9: C17.1 R21.2 ; off-sheet VC9
VC10: C11.1 R11.2 ; off-sheet VC10
VC11: C32.1 R48.2 ; off-sheet VC11
VC12: C23.1 R37.2 ; off-sheet VC12
NetC12_2: C12.2 Q2.G R12.2 R14.1
NetC16_1: C16.1 Q3.G(GATE) R18.1 R19.1
NetC21_1: C21.1 Q4.G(GATE) R27.1 R29.1
NetC22_1: C22.1 Q5.G(GATE) R28.1 R30.1
NetC26_2: C26.2 Q8.G R38.2 R39.1
NetC30_1: C30.1 Q6.G(GATE) R40.1 R43.1
NetC31_1: C31.1 Q7.G(GATE) R41.1 R44.1
NetC33_2: C33.2 Q11.G R53.2 R54.1
NetC39_1: C39.1 Q9.G(GATE) R55.1 R58.1
NetC40_1: C40.1 Q10.G(GATE) R56.1 R59.1
NetC45_1: C45.1 Q12.G(GATE) R67.1 R69.1
NetC46_1: C46.1 Q13.G(GATE) R68.1 R70.1
NetD3_C: D3.C(CATHODE) R15.1
NetD4_A: D4.A(ANODE) R17.1
NetD5_C: D5.C(CATHODE) R24.1
NetD6_C: D6.C(CATHODE) R26.1
NetD7_C: D7.C(CATHODE) R33.1
NetD8_C: D8.C(CATHODE) R35.1
NetD9_A: D9.A(ANODE) R42.1
NetD10_C: D10.C(CATHODE) R49.1
NetD11_C: D11.C(CATHODE) R51.1
NetD12_A: D12.A(ANODE) R57.1
NetD13_C: D13.C(CATHODE) R63.1
NetD14_C: D14.C(CATHODE) R65.1
NetQ2_D: Q2.D R17.2 R20.2
NetQ3_D: Q3.D(DRAIN) R13.1 R15.2
NetQ4_D: Q4.D(DRAIN) R22.1 R24.2
NetQ5_D: Q5.D(DRAIN) R23.1 R26.2
NetQ6_D: Q6.D(DRAIN) R31.1 R33.2
NetQ7_D: Q7.D(DRAIN) R32.1 R35.2
NetQ8_D: Q8.D R42.2 R45.2
NetQ9_D: Q9.D(DRAIN) R46.1 R49.2
NetQ10_D: Q10.D(DRAIN) R47.1 R51.2
NetQ11_D: Q11.D R57.2 R60.2
NetQ12_D: Q12.D(DRAIN) R61.1 R63.2
NetQ13_D: Q13.D(DRAIN) R62.1 R65.2

### Notes on the sheet
- Title
- MATTERNET
- PROPRIETRY & CONFIDENTIAL
  THE INFORMATION CONTAINS IN THIS DRAWING
  IS THE SOLE PROPERTY OF  MATTERNET Inc.
  ANY REPRODUCTION IN PART OR AS WHOLE
  WITHOUT A WRITTEN PERMISSION OF
  MATTERNET Inc. IS PROHIBITED
- Size:
- Date:
- File:
- C
- Number:
- Time:
- Revision:
- Sheet
- of
- 161 E. Evelyn Ave.
- Mountain View,
- CA 94041 USA

### Library data of the parts
C11 C14 C17 C18 C23-C25 C32 C34 C35 C41 C42 C47 = CAP-Generic-0402: CAP CER 0.022UF 100V X7R 0603; Manufacturer: Murata; Manufacturer Part Number: GCJ188R72A223KA01D; Capacitance: 22nF; Tolerance: 10%; ComponentLink1URL: http://www.mouser.com/ds/2/212/KEM_C1002_X7R_SMD-1102033.pdf; ComponentLink1Description: http://www.mouser.com/ds/2/212/KEM_C1002_X7R_SMD-1102033.pdf; ComponentLink2URL: https://www.verical.com/server-webapp/html/getDatasheet?partID=38414; ComponentLink2Description: https://www.verical.com/server-webapp/html/getDatasheet?partID=38414; Supplier 1: Digi-Key; Supplier Part Number 1: 490-5769-1-ND; Stock 1: 480265; Pricing 1: 1=0.4, 10=0.277, 100=0.1572, 500=0.11096, 1000=0.0971 (USD); Mount: Surface Mount; Case/Package: 0603; Case Code (Metric): 1608; Case Code (Imperial): 0603; Min Operating Temperature: -55°C; Max Operating Temperature: 125°C; Dielectric: X7R; Package Quantity: 4000; Voltage Rating: 100V; Packaging: Tape and Reel; Termination: SMD/SMT; Voltage Rating (DC): 100V; Features: Soft Termination; Length: 1.6mm; Height: 0.8mm; Width: 0.031inch; Thickness: 0.031inch; Depth: 0.8mm; Ratings: AEC-Q200; Radiation Hardening: No; Lead Free: Lead Free; ComponentLink3URL: https://www.murata.com/~/media/webrenewal/support/library/catalog/products/capacitor/mlcc/c03e.ashx?la=en-us&src-supplier=Digi-Key; ComponentLink3Description: https://www.murata.com/~/media/webrenewal/support/library/catalog/products/capacitor/mlcc/c03e.ashx?la=en-us&src-supplier=Digi-Key; ComponentLink4URL: http://search.murata.co.jp/Ceramy/image/img/A01X/partnumbering_e_02.pdf?src-supplier=Digi-Key; ComponentLink4Description: http://search.murata.co.jp/Ceramy/image/img/A01X/partnumbering_e_02.pdf?src-supplier=Digi-Key
C12 C16 C21 C22 C26 C30 C31 C33 C39 C40 C45 C46 = CAP-Generic-0603: CAP CER 10000PF 50V X7R 0603; Manufacturer: TDK; Manufacturer Part Number: CGA3E2X7R1H103K080AE; Capacitance: 10nF; Tolerance: 10%; Supplier 1: Digi-Key; Supplier Part Number 1: 445-15955-1-ND; Stock 1: 42633; Pricing 1: 1=0.27, 10=0.186, 100=0.0944, 500=0.06458, 1000=0.05713 (USD); Mount: Surface Mount; Case/Package: 0603; Weight: 7.1E-05oz; Case Code (Metric): 1608; Case Code (Imperial): 0603; Min Operating Temperature: -55°C; Max Operating Temperature: 125°C; Package Quantity: 4000; Packaging: Tape and Reel; Voltage Rating: 50V; Dielectric: X7R; Termination: SMD/SMT; Voltage Rating (DC): 50V; Features: Soft Termination; Length: 0.063inch; Height: 0.8mm; Width: 0.031inch; Thickness: 0.035inch; Ratings: AEC-Q200
C13 C15 C19 C20 C27-C29 C36-C38 C43 C44 = CAP-Generic-0603: CAP CER 0.1UF 50V 10% X7R 0603; Manufacturer: Murata; Manufacturer Part Number: GCJ188R71E104KA12D; Supplier 1: Digi-Key; Supplier Part Number 1: 490-16477-1-ND; Stock 1: 2560; Pricing 1: 1=0.22, 10=0.152, 100=0.077, 500=0.0527, 1000=0.04662 (USD); Case/Package: 0603; Supplier 2: Mouser; Supplier Part Number 2: 81-GCJ188R71E104KA2D; Stock 2: 47905; Pricing 2: 1=0.21, 10=0.139, 50=0.139, 100=0.071, 1000=0.043, 10000=0.035 (USD)
D3-D14 = LED-GENERIC: as D2 on sheet PG04_ BALANCER
Q2 Q8 Q11 = FET-P-CH-Generic_OP4_0: MOSFET P-CH 60V 1.1A SOT-23; Manufacturer: ON Semiconductor; Supplier 1: Digi-Key; Supplier Part Number 1: NVR5124PLT1GOSCT-ND; Manufacturer Part Number: NVR5124PLT1G; Stock 1: 6451; Pricing 1: 1=0.61, 10=0.477, 100=0.3272, 500=0.22434, 1000=0.16826 (USD); Lead Free: Lead Free; Supplier 2: Mouser; Supplier Part Number 2: 863-NVR5124PLT1G; Stock 2: 58977; Pricing 2: 1=0.48, 10=0.366, 50=0.366, 100=0.198, 1000=0.149, 10000=0.12 (USD)
Q3-Q7 Q9 Q10 Q12 Q13 = FET-NCH-GenericOp2: MOSFET N-CH 60V 280MA SOT-23; Manufacturer: ON Semiconductor / Fairchild; custprt: 100-0300-000088; custinv: Ansync; Option: AB; Drain to Source Resistance: 1.2R; Gate to Source Voltage (Vgs): 20V; Input Capacitance: 50pF; Max Power Dissipation: 300mW; Element Configuration: Single; Rds On Max: 2R; Number of Elements: 1; Threshold Voltage: 2.1V; Current: 28A; Supplier 1: Digi-Key; Supplier Part Number 1: NDS7002ACT-ND; Manufacturer Part Number: NDS7002A; Stock 1: 419; Pricing 1: 1=0.51, 10=0.368, 100=0.2168, 500=0.1227, 1000=0.09407 (USD); Mount: Surface Mount; Case/Package: SOT-23; Number of Pins: 3; Contact Plating: Matte,Tin; Min Operating Temperature: -65°C; Max Operating Temperature: 150°C; Continuous Drain Current (ID): 280mA; Packaging: Tape and Reel; Drain to Source Voltage (Vdss): 60V; Drain to Source Breakdown Voltage: 60V; Power Dissipation: 300mW; Package Quantity: 1; Voltage Rating (DC): 60V; Current Rating: 280mA; On-State Resistance: 2R; Nominal Vgs: 2.1V; Dual Supply Voltage: 60V; Voltage: 60V; Width: 3.05mm; Radiation Hardening: No; Lead Free: Lead Free; REACH SVHC: No SVHC; ComponentLink1URL: https://www.fairchildsemi.com/package-drawings/MA/MA03B.pdf; ComponentLink1Description: https://www.fairchildsemi.com/package-drawings/MA/MA03B.pdf; ComponentLink2URL: https://www.verical.com/server-webapp/html/getDatasheet?partID=44394; ComponentLink2Description: https://www.verical.com/server-webapp/html/getDatasheet?partID=44394; ComponentLink3URL: https://www.fairchildsemi.com/datasheets/ND/NDS7002A.pdf; ComponentLink3Description: https://www.fairchildsemi.com/datasheets/ND/NDS7002A.pdf; ComponentLink4URL: http://www.farnell.com/datasheets/660093.pdf; ComponentLink4Description: http://www.farnell.com/datasheets/660093.pdf; ComponentLink5URL: http://www.jameco.com/Jameco/Products/ProdDS/874832.pdf; ComponentLink5Description: http://www.jameco.com/Jameco/Products/ProdDS/874832.pdf; ComponentLink6URL: http://www.fairchildsemi.com/ds/ND/NDS7002A.pdf; ComponentLink6Description: http://www.fairchildsemi.com/ds/ND/NDS7002A.pdf; Supplier 2: Mouser; Supplier Part Number 2: 512-NDS7002A; Stock 2: 2771; Pricing 2: 1=0.41, 10=0.261, 50=0.261, 100=0.112, 1000=0.086, 10000=0.058 (USD)
R11 R15-R17 R21 R24-R26 R33-R37 R42 R48-R52 R57 R63-R66 R71 = R-Generic-0402: RES SMD 1K OHM 5% 1/16W 0402; Manufacturer: Yageo; Manufacturer Part Number: RC0402JR-071KL; custinv: Ansync; custprt: 100-0120-000074; Option: AB; Resistance: 1kR; Power Rating: 62.5mW; Voltage Rating: 50V; Temperature Coefficient: 100ppm/°C; Max Power Dissipation: 63mW; Supplier 1: Digi-Key; Supplier Part Number 1: 311-1.0KJRCT-ND; Stock 1: 18546768; Pricing 1: 1=0.1, 10=0.015, 100=0.006, 1000=0.00268, 2500=0.00233, 5000=0.00192 (USD); Case/Package: 0402; Case Code (Imperial): 0402; Case Code (Metric): 1005; Min Operating Temperature: -55°C; Max Operating Temperature: 155°C; Tolerance: 5%; Packaging: Tape and Reel; Package Quantity: 1; Termination: SMD/SMT; Composition: Thick Film; Number of Terminations: 2; Military Standard: Not; Features: Moisture Resistant; Length: 0.039inch; Height: 0.016inch; Width: 0.02inch; Depth: 0.5mm; REACH SVHC: No SVHC; Lead Free: Lead Free; ComponentLink1URL: http://www.yageo.com/documents/recent/PYu-RC_Group_51_RoHS_L_9.pdf; ComponentLink1Description: http://www.yageo.com/documents/recent/PYu-RC_Group_51_RoHS_L_9.pdf; ComponentLink2URL: http://www.farnell.com/datasheets/1018594.pdf; ComponentLink2Description: http://www.farnell.com/datasheets/1018594.pdf; ComponentLink3URL: http://www.yageo.com/documents/recent/PYu-RC0402_51_RoHS_L_6_r.pdf; ComponentLink3Description: http://www.yageo.com/documents/recent/PYu-RC0402_51_RoHS_L_6_r.pdf
R12 R19 R29 R30 R38 R43 R44 R53 R58 R59 R69 R70 = R-Generic-0603: RES SMD 330K OHM 5% 1/10W 0603; Manufacturer: Yageo; Manufacturer Part Number: RC0603JR-07330KL; custprt: 100-0110-000011; custinv: Ansync; Option: AB; Resistance: 330kR; Power Rating: 100mW; Voltage Rating: 75V; Voltage Rating (DC): 50V; Temperature Coefficient: 100ppm/°C; Supplier 1: Digi-Key; Supplier Part Number 1: 311-330KGRCT-ND; Stock 1: 271870; Pricing 1: 1=0.1, 10=0.022, 100=0.0088, 1000=0.00396, 2500=0.00344 (USD); Case/Package: 0603; Number of Pins: 2; Weight: 7.1E-05oz; Case Code (Imperial): 0603; Case Code (Metric): 1608; Min Operating Temperature: -55°C; Max Operating Temperature: 155°C; Tolerance: 5%; Packaging: Tape and Reel; Package Quantity: 1; Termination: SMD/SMT; Composition: Thick Film; Number of Terminations: 2; Military Standard: Not; Max Power Dissipation: 100mW; Features: Moisture Resistant; Length: 1.6mm; Height: 0.022inch; Width: 0.8mm; Depth: 0.8mm; REACH SVHC: No SVHC; Lead Free: Lead Free; ComponentLink1URL: http://www.yageo.com/documents/recent/PYu-RC_Group_51_RoHS_L_9.pdf; ComponentLink1Description: http://www.yageo.com/documents/recent/PYu-RC_Group_51_RoHS_L_9.pdf; ComponentLink2URL: http://www.farnell.com/datasheets/443971.pdf; ComponentLink2Description: http://www.farnell.com/datasheets/443971.pdf; ComponentLink3URL: https://www.verical.com/server-webapp/html/getDatasheet?partID=323834; ComponentLink3Description: https://www.verical.com/server-webapp/html/getDatasheet?partID=323834
R13 R20 R22 R23 R31 R32 R45-R47 R60-R62 = R-Generic: RES SMD 42.2 OHM 1% 1.5W 2512; Manufacturer: Vishay Dale; Manufacturer Part Number: CRCW251242R2FKEGHP; custprt: 100-0100-000214; custinv: Ansync; Option: AB; Resistance: 42.2R; Temperature Coefficient: 100ppm/°C; Supplier 1: Digi-Key; Supplier Part Number 1: 541-42.2RCT-ND; Stock 1: 1751; Pricing 1: 1=0.74, 10=0.618, 100=0.4152, 1000=0.27302 (USD); Case/Package: 2512; Case Code (Metric): 6432; Case Code (Imperial): 2512; Min Operating Temperature: -55°C; Max Operating Temperature: 155°C; Package Quantity: 2000; Packaging: Tape and Reel; Composition: Thick Film; Number of Terminations: 2; Tolerance: 1%; Max Power Dissipation: 1.5W; Features: Automotive AEC-Q200; Length: 0.248inch; Height: 0.028inch; Width: 0.124inch; Lead Free: Lead Free
R14 R18 R27 R28 R39-R41 R54-R56 R67 R68 = R-Generic-0402: RES SMD 10K OHM 1% 1/16W 0402; Manufacturer: Vishay Dale; Manufacturer Part Number: CRCW040210K0FKTD; Resistance: 10kR; Power Rating: 63mW; Voltage Rating: 50V; Temperature Coefficient: 100ppm/°C; ComponentLink1URL: http://www.yageo.com/documents/recent/PYu-RC_Group_51_RoHS_L_9.pdf; ComponentLink1Description: http://www.yageo.com/documents/recent/PYu-RC_Group_51_RoHS_L_9.pdf; ComponentLink2URL: http://www.mouser.com/ds/2/447/PYu-RC0402_51_RoHS_L_6_r-8721.pdf; ComponentLink2Description: http://www.mouser.com/ds/2/447/PYu-RC0402_51_RoHS_L_6_r-8721.pdf; ComponentLink3URL: http://www.farnell.com/datasheets/1018594.pdf; ComponentLink3Description: http://www.farnell.com/datasheets/1018594.pdf; Supplier 1: Digi-Key; Supplier Part Number 1: 541-2955-1-ND; Stock 1: 17223; Pricing 1: 1=0.15, 10=0.132, 100=0.0508, 1000=0.02236, 2500=0.01931, 5000=0.01728 (USD); Mount: Surface Mount; Case/Package: 0402; Number of Pins: 2; Weight: 2.3E-05oz; Case Code (Metric): 1005; Case Code (Imperial): 0402; Contact Plating: Lead,Tin; Min Operating Temperature: -55°C; Max Operating Temperature: 155°C; Tolerance: 1%; Packaging: Tape and Reel; Package Quantity: 10000; Composition: Thick Film; Number of Terminations: 2; Military Standard: Not; Max Power Dissipation: 63mW; Voltage Rating (DC): 50V; Features: Automotive AEC-Q200; Length: 1mm; Height: 0.016inch; Width: 0.02inch; Depth: 0.5mm; Radiation Hardening: No; Lead Free: Contains Lead; REACH SVHC: Unknown; ComponentLink4URL: http://www.vishay.com/docs/20008/dcrcw.pdf?src-supplier=Digi-Key; ComponentLink4Description: http://www.vishay.com/docs/20008/dcrcw.pdf?src-supplier=Digi-Key; ComponentLink5URL: https://www.verical.com/server-webapp/html/getDatasheet?partID=104182&src-supplier=Verical; ComponentLink5Description: https://www.verical.com/server-webapp/html/getDatasheet?partID=104182&src-supplier=Verical; ComponentLink6URL: http://www.vishay.com/docs/20008/dcrcw.pdf?src-supplier=Avnet; ComponentLink6Description: http://www.vishay.com/docs/20008/dcrcw.pdf?src-supplier=Avnet

## Sheet PG09_ TEMP_BALANCER.SchDoc: BMU - Thermistor Monitors
size B; Address1: 3511 EDISON WAY; Address2: MENLO PARK, CA, 94025; DocumentNumber: 1; Revision: 4.1; SheetNumber: 4; SheetTotal: 9
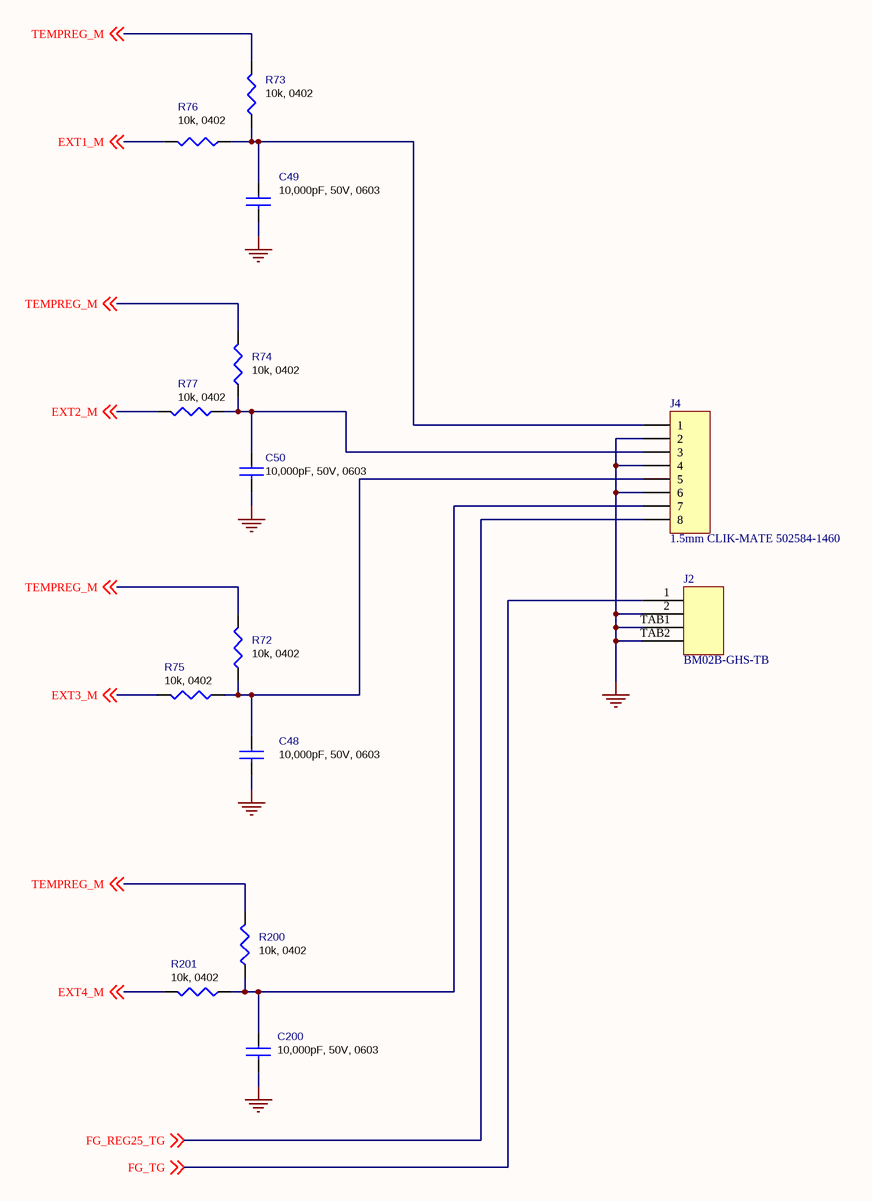
[diagram p2: PG09_ TEMP_BALANCER.SchDoc]

### Parts
C48  10,000pF, 50V, 0603  [C0603]
C49  10,000pF, 50V, 0603  [C0603]
C50  10,000pF, 50V, 0603  [C0603]
C200  10,000pF, 50V, 0603  [C0603]
J2  BM02B-GHS-TB  [BM02B-GHS-TBT]
J4  1.5mm CLIK-MATE 502584-1460  [CONN8_1P5MM_SM]
R72  10k, 0402  [R0402]
R73  10k, 0402  [R0402]
R74  10k, 0402  [R0402]
R75  10k, 0402  [R0402]
R76  10k, 0402  [R0402]
R77  10k, 0402  [R0402]
R200  10k, 0402  [R0402]
R201  10k, 0402  [R0402]

### Nets
GND: C48.2 C49.2 C50.2 C200.2 J2.2 J2.TAB1 J2.TAB2 J4.2 J4.4 J4.6
EXT1_M: R76.2 ; off-sheet EXT1_M
EXT2_M: R77.2 ; off-sheet EXT2_M
EXT3_M: R75.2 ; off-sheet EXT3_M
EXT4_M: R201.2 ; off-sheet EXT4_M
FG_REG25_TG: J4.8 ; off-sheet FG_REG25_TG
FG_TG: J2.1 ; off-sheet FG_TG
TEMPREG_M: R72.2 R73.2 R74.2 R200.2 ; off-sheet TEMPREG_M
NetC48_1: C48.1 J4.5 R72.1 R75.1
NetC49_1: C49.1 J4.1 R73.1 R76.1
NetC50_1: C50.1 J4.3 R74.1 R77.1
NetC200_1: C200.1 J4.7 R200.1 R201.1

### Notes on the sheet
- Title
- Size:
- Date:
- B
- Number:
- Time:
- Revision:
- Sheet
- of
- MATTERNET
- 161 E. Evelyn Ave.
- Mountain View,
- CA 94041 USA
- PROPRIETRY & CONFIDENTIAL
  THE INFORMATION CONTAINS IN THIS DRAWING
  IS THE SOLE PROPERTY OF  MATTERNET Inc.
  ANY REPRODUCTION IN PART OR AS WHOLE
  WITHOUT A WRITTEN PERMISSION OF
  MATTERNET Inc. IS PROHIBITED
- File:

### Library data of the parts
C48-C50 C200 = CAP-Generic-0603: as C12 on sheet PG05_ CELLS; Supplier 1: Digi-Key; Supplier Part Number 1: 445-15955-1-ND; Stock 1: 42633; Pricing 1: 1=0.27, 10=0.186, 100=0.0944, 500=0.06458, 1000=0.05713 (USD); Mount: Surface Mount; Case/Package: 0603; Weight: 7.1E-05oz; Case Code (Metric): 1608; Case Code (Imperial): 0603; Min Operating Temperature: -55°C; Max Operating Temperature: 125°C; Package Quantity: 4000; Packaging: Tape and Reel; Voltage Rating: 50V; Dielectric: X7R; Termination: SMD/SMT; Voltage Rating (DC): 50V; Features: Soft Termination; Length: 0.063inch; Height: 0.8mm; Width: 0.031inch; Thickness: 0.035inch; Ratings: AEC-Q200
J2 = BM02B-GHS-TBT: CONN HEADER GH TOP 2POS 1.25MM; System: Connector; ComponentLink1Description: *; ComponentLink1URL: *; Supplier 1: Heilind Electronics; Supplier Part Number 1: JSTBM02B-GHS-TBT(LF)(SN)N; Supplier 2: Digi-Key; Supplier Part Number 2: 455-1578-1-ND
J4 = Header 8: CONN RCPT 8POS 0.059 TIN SMD; Manufacturer: Molex; Manufacturer Part Number: 502584-0860; Current Rating: 2A; Voltage Rating: 100V; Number of Positions: 8; Connector Type: Center Strip Contact,Receptacle; Gender: Female; Glow Wire Compliant: Non-compliant; Supplier 1: Digi-Key; Supplier Part Number 1: WM14465CT-ND; Stock 1: 1932; Pricing 1: 1=1.52, 10=1.382, 100=1.1846 (USD); Mount: Surface Mount; Color: Beige; Contact Plating: Tin; Housing Color: Beige; Housing Material: Thermoplastic; Contact Material: Copper Alloy; Min Operating Temperature: -25°C; Max Operating Temperature: 85°C; Contact Gender: Female; Package Quantity: 900; Number of Rows: 1; Packaging: Tape and Reel; Fastening Type: Latch; Termination: Solder; Number of Contacts: 8; Orientation: Vertical; Number of Circuits: 8; Length: 16.3mm; Pitch: 1.5mm; Depth: 6.35mm; Radiation Hardening: No; REACH SVHC: No SVHC; ComponentLink1URL: http://www.onlinecomponents.com/productFiles/mf-MOL/625135025840860_pcb_receptacles.pdf?src-supplier=Onlinecomponents.com; ComponentLink1Description: http://www.onlinecomponents.com/productFiles/mf-MOL/625135025840860_pcb_receptacles.pdf?src-supplier=Onlinecomponents.com; ComponentLink2URL: http://www.onlinecomponents.com/productFiles/mf-MOL/143515025840860_pcb_receptacles.pdf?src-supplier=Onlinecomponents.com; ComponentLink2Description: http://www.onlinecomponents.com/productFiles/mf-MOL/143515025840860_pcb_receptacles.pdf?src-supplier=Onlinecomponents.com; ComponentLink3URL: http://www.mouser.com/ds/2/276/5025840860_PCB_RECEPTACLES-179325.pdf?src-supplier=Mouser; ComponentLink3Description: http://www.mouser.com/ds/2/276/5025840860_PCB_RECEPTACLES-179325.pdf?src-supplier=Mouser; ComponentLink4URL: http://www.molex.com/webdocs/datasheets/pdf/en-us/5025840860_PCB_RECEPTACLES.pdf?src-supplier=Avnet; ComponentLink4Description: http://www.molex.com/webdocs/datasheets/pdf/en-us/5025840860_PCB_RECEPTACLES.pdf?src-supplier=Avnet; ComponentLink5URL: http://www.molex.com/pdm_docs/sd/5025840860_sd.pdf?src-supplier=Digi-Key; ComponentLink5Description: http://www.molex.com/pdm_docs/sd/5025840860_sd.pdf?src-supplier=Digi-Key
R72-R77 R200 R201 = R-Generic-0402: as R14 on sheet PG05_ CELLS; ComponentLink1URL: http://www.yageo.com/documents/recent/PYu-RC_Group_51_RoHS_L_9.pdf; ComponentLink1Description: http://www.yageo.com/documents/recent/PYu-RC_Group_51_RoHS_L_9.pdf; ComponentLink2URL: http://www.mouser.com/ds/2/447/PYu-RC0402_51_RoHS_L_6_r-8721.pdf; ComponentLink2Description: http://www.mouser.com/ds/2/447/PYu-RC0402_51_RoHS_L_6_r-8721.pdf; ComponentLink3URL: http://www.farnell.com/datasheets/1018594.pdf; ComponentLink3Description: http://www.farnell.com/datasheets/1018594.pdf; Supplier 1: Digi-Key; Supplier Part Number 1: 541-2955-1-ND; Stock 1: 17223; Pricing 1: 1=0.15, 10=0.132, 100=0.0508, 1000=0.02236, 2500=0.01931, 5000=0.01728 (USD); Mount: Surface Mount; Case/Package: 0402; Number of Pins: 2; Weight: 2.3E-05oz; Case Code (Metric): 1005; Case Code (Imperial): 0402; Contact Plating: Lead,Tin; Min Operating Temperature: -55°C; Max Operating Temperature: 155°C; Tolerance: 1%; Packaging: Tape and Reel; Package Quantity: 10000; Composition: Thick Film; Number of Terminations: 2; Military Standard: Not; Max Power Dissipation: 63mW; Voltage Rating (DC): 50V; Features: Automotive AEC-Q200; Length: 1mm; Height: 0.016inch; Width: 0.02inch; Depth: 0.5mm; Radiation Hardening: No; Lead Free: Contains Lead; REACH SVHC: Unknown; ComponentLink4URL: http://www.vishay.com/docs/20008/dcrcw.pdf?src-supplier=Digi-Key; ComponentLink4Description: http://www.vishay.com/docs/20008/dcrcw.pdf?src-supplier=Digi-Key; ComponentLink5URL: https://www.verical.com/server-webapp/html/getDatasheet?partID=104182&src-supplier=Verical; ComponentLink5Description: https://www.verical.com/server-webapp/html/getDatasheet?partID=104182&src-supplier=Verical; ComponentLink6URL: http://www.vishay.com/docs/20008/dcrcw.pdf?src-supplier=Avnet; ComponentLink6Description: http://www.vishay.com/docs/20008/dcrcw.pdf?src-supplier=Avnet